# Altium schematic sheet 3_0V_2_5V_DIST.SchDoc: 3V, 2.5V dist.
size Letter; Organization: University of California; Address1: 475 Portola Plaza; Address2: Los Angeles, CA 90095; Revision: R01; SheetNumber: 1; SheetTotal: 1
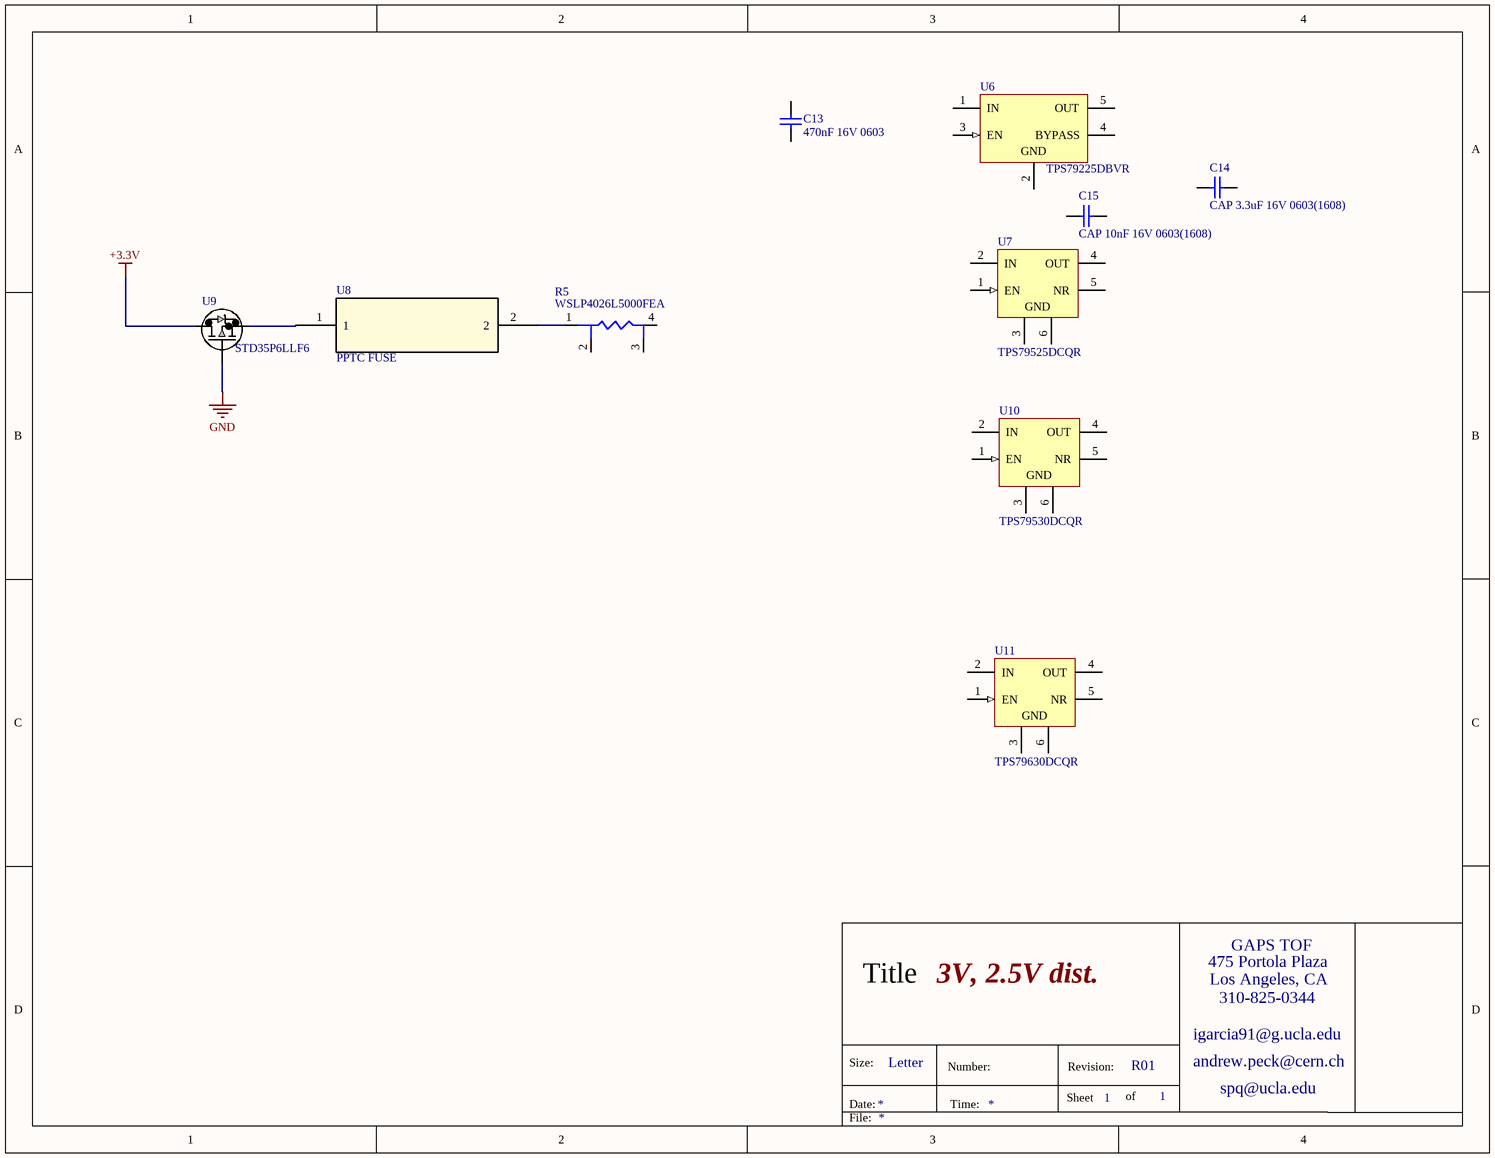
[diagram p0: 3_0V_2_5V_DIST.SchDoc]

## Parts
C13  470nF 16V 0603  [CAPC0603(1608)100_M]
C14  CAP 3.3uF 16V 0603(1608)  [CAPC0603(1608)100_L]
C15  CAP 10nF 16V 0603(1608)  [CAPC0603(1608)100_L]
R5  WSLP4026L5000FEA
U6  TPS79225DBVR  [DBV0005A_M]
U7  TPS79525DCQR  [DCQ0006A_L]
U8  PPTC FUSE  [0ZCF]
U9  STD35P6LLF6  [DPAK]
U10  TPS79530DCQR  [DCQ0006A_L]
U11  TPS79630DCQR  [DCQ0006A_L]

## Nets
+3.3V: U9.2(D)
GND: U9.1(G)
NetR5_1: R5.1 U8.2
NetU8_1: U8.1 U9.3(S)

Not connected (* = marked no-connect by the designer): C13 1 2; C14 1 2; C15 1 2; R5 2 3 4; U6 1(IN) 2(GND) 3(EN) 4(BYPASS) 5(OUT); U7 1(EN) 2(IN) 3(GND) 4(OUT) 5(NR) 6(GND); U10 1(EN) 2(IN) 3(GND) 4(OUT) 5(NR) 6(GND); U11 1(EN) 2(IN) 3(GND) 4(OUT) 5(NR) 6(GND)

## Notes on the sheet
- 475 Portola Plaza
- GAPS TOF
- Title
- igarcia91@g.ucla.edu
- Los Angeles, CA
- 310-825-0344
- Size:
- Date:
- Letter
- Number:
- Time:
- Sheet
- Revision:
- of
- andrew.peck@cern.ch
- spq@ucla.edu
- File:

## Library data of the parts
C13 = CMP-1035-02700-1: CAP 470nF 16V ±10% 0603 (1608 Metric) Thickness 1mm SMD; Tolerance: Â±10%; Case-EIA: 0603; Case-Metric: 1608; Technology: SMT; Max Thickness: 1 mm; Value: 470nF; Rated Voltage: 16 V
C14 = CMP-1035-02774-1: CAP 3.3uF 16V ±20% 0603 (1608 Metric) Thickness 1mm SMD; Case-Metric: 1608; Tolerance: Â±20%; Case-EIA: 0603; Technology: SMT; Rated Voltage: 16 V; Max Thickness: 1 mm; Value: 3.3uF
C15 = CMP-1035-02311-1: CAP 10nF 16V ±10% 0603 (1608 Metric) Thickness 1mm SMD; Case-EIA: 0603; Case-Metric: 1608; Tolerance: Â±10%; Rated Voltage: 16 V; Value: 10nF; Max Thickness: 1 mm; Technology: SMT
R5 = WSLP4026L5000FEA: Current Sense Resistors - SMD 7watt .0005ohm 1%
U6 = CMP-0394-00239-2: Single Output High PSRR LDO, 100 mA, Fixed 2.5 V Output, 2.7 to 5.5 V Input, 5-pin SOT-23 (DBV), -40 to 125 degC, Green (RoHS & no Sb/Br); Manufacturer: Texas Instruments; Vdo(Typ)(mV): 55; Vin(Max)(V): 5.5; Vout Adj(Max)(V): 2.5; Vin(Min)(V): 2.7; Accuracy(%): 2; Iout(Max)(A): 0.1; SubFamily: Single Channel LDO; Iq(Typ)(mA): 0.2; Rating: Catalog; ComponentLink4Description: URL Link1; ComponentLink3Description: Package Specification; Mounting Technology: Surface Mount; ComponentLink2URL: http://www.ti.com/general/docs/lit/getliterature.tsp?genericPartNumber=TPS79225&fileType=pdf; ComponentLink1URL: http://www.ti.com/; PackageReference: DBV0005A; ComponentLink3URL: http://www.ti.com/litv/pdf/mpds018i; ComponentLink2Description: Datasheet; Fixed Output Options(V): 2.5; Vout Adj(Min)(V): 2.5; PackageVersion: 4073253-4/K; PartNumber: TPS79225DBVR; Eco-Plan: Green (RoHS & no Sb/Br); DatasheetVersion: SLVS337B; Code_JEDEC: MO-178; ComponentLink4URL: Samples URL:http://www.ti.com/product/tps79225#samples; PackageDescription: 5-Pin Plastic Small Outline, Body 1.60 Ãƒâ€” 2.90 mm, Pitch 0.95 mm; ComponentLink1Description: Manufacturer URL
U7 = CMP-0395-00444-2: Single Output High PSRR LDO, 500 mA, Fixed 2.5 V Output, 2.7 to 5.5 V Input, 6-pin SOT-223 (DCQ), -40 to 125 degC, Green (RoHS & no Sb/Br); Manufacturer: Texas Instruments; Iout(Max)(A): 0.5; Vout Adj(Min)(V): 2.5; Vin(Max)(V): 5.5; SubFamily: Single Channel LDO; Vdo(Typ)(mV): 110; Rating: Catalog; Accuracy(%): 2; Iq(Typ)(mA): 0.26; Vin(Min)(V): 2.7; ComponentLink3URL: http://www.ti.com/litv/pdf/mpds098c; ComponentLink1URL: http://www.ti.com/; Eco-Plan: Green (RoHS & no Sb/Br); PackageDescription: 6-Pin Plastic Small Outline, Body 3.5 x 6.5 mm, Pitch 1.27 mm; PartNumber: TPS79525DCQR; Fixed Output Options(V): 2.5; ComponentLink1Description: Manufacturer URL; PackageReference: DCQ0006A; ComponentLink2Description: Datasheet; Vout Adj(Max)(V): 2.5; ComponentLink3Description: Package Specification; ComponentLink2URL: http://www.ti.com/general/docs/lit/getliterature.tsp?genericPartNumber=TPS79525&fileType=pdf; Mounting Technology: Surface Mount; DatasheetVersion: SLVS350H; PackageVersion: 4202109/D
U8 = 0ZCF0250FF2C: Resettable Fuses - PPTC; Vendor: Belfuse; Built_By: EMA_UL_Team; C: Copyright (C) 2016 Accelerated Designs. All rights reserved; Manufacturer_Part_Number: 0ZCF0250FF2C; RefDes: RefDes; Type: DEV; Value: Value
U9 = STD35P6LLF6: MOSFET P-channel 60 V, 0.025 Ohm typ., 35 A STripFET F6 Power MOSFET in a DPAK package; Manufacturer_Part_Number: STD35NF06T4; Vendor: STMicroelectronics; Built_By: EMA_UL_Team; C: Copyright (C) 2015 Accelerated Designs. All rights reserved; RefDes: RefDes; Type: DEV; Value: Value
U10 = CMP-0395-00302-2: Single Output High PSRR LDO, 500 mA, Fixed 3 V Output, 2.7 to 5.5 V Input, 6-pin SOT-223 (DCQ), -40 to 125 degC, Green (RoHS & no Sb/Br); Manufacturer: Texas Instruments; Accuracy(%): 2; Fixed Output Options(V): 3; Iq(Typ)(mA): 0.26; Vdo(Typ)(mV): 110; Vin(Min)(V): 2.7; Vin(Max)(V): 5.5; Iout(Max)(A): 0.5; Rating: Catalog; SubFamily: Single Channel LDO; ComponentLink2URL: http://www.ti.com/general/docs/lit/getliterature.tsp?genericPartNumber=TPS79530&fileType=pdf; PackageDescription: 6-Pin Plastic Small Outline, Body 3.5 x 6.5 mm, Pitch 1.27 mm; Mounting Technology: Surface Mount; ComponentLink1URL: http://www.ti.com/; ComponentLink3URL: http://www.ti.com/litv/pdf/mpds098c; DatasheetVersion: SLVS350H; Vout Adj(Max)(V): 3; PackageVersion: 4202109/D; ComponentLink2Description: Datasheet; Vout Adj(Min)(V): 3; Eco-Plan: Green (RoHS & no Sb/Br); PartNumber: TPS79530DCQR; ComponentLink3Description: Package Specification; ComponentLink1Description: Manufacturer URL; PackageReference: DCQ0006A
U11 = CMP-0395-00336-2: Single Output High PSRR LDO, 1 A, Fixed 3 V Output, 2.7 to 5.5 V Input, 6-pin SOT-223 (DCQ), -40 to 125 degC, Green (RoHS & no Sb/Br); Manufacturer: Texas Instruments; Fixed Output Options(V): 3; Vdo(Typ)(mV): 250; Iout(Max)(A): 1; Vin(Min)(V): 2.7; SubFamily: Single Channel LDO; Accuracy(%): 2; Vin(Max)(V): 5.5; Iq(Typ)(mA): 0.26; ComponentLink1URL: http://www.ti.com/; ComponentLink1Description: Manufacturer URL; ComponentLink3URL: http://www.ti.com/litv/pdf/mpds098c; Mounting Technology: Surface Mount; Vout Adj(Max)(V): 3; Vout Adj(Min)(V): 3; ComponentLink2Description: Datasheet; ComponentLink3Description: Package Specification; DatasheetVersion: SLVS351N; PackageVersion: 4202109/D; ComponentLink2URL: http://www.ti.com/general/docs/lit/getliterature.tsp?genericPartNumber=TPS79630&fileType=pdf; Eco-Plan: Green (RoHS & no Sb/Br); PackageReference: DCQ0006A; PackageDescription: 6-Pin Plastic Small Outline, Body 3.5 x 6.5 mm, Pitch 1.27 mm; PartNumber: TPS79630DCQR